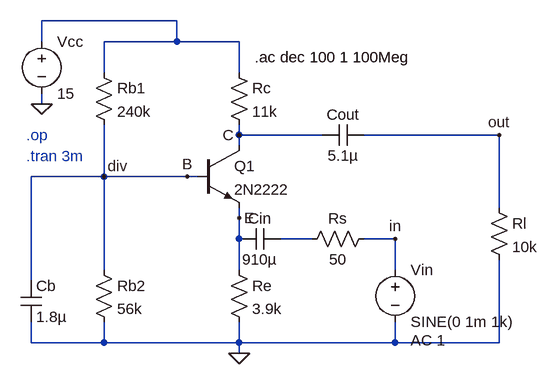
[diagram p0: schematic common_base_amplifier.asc]
common_base_amplifier.asc, the LTspice schematic file:
Version 4.1
SHEET 1 880 680
WIRE 128 -48 -80 -48
WIRE -80 -16 -80 -48
WIRE 128 -16 128 -48
WIRE 128 -16 16 -16
WIRE 224 -16 128 -16
WIRE 16 32 16 -16
WIRE 224 32 224 -16
WIRE -80 80 -80 64
WIRE 224 128 224 112
WIRE 352 128 224 128
WIRE 624 128 416 128
WIRE 224 144 224 128
WIRE 16 192 16 112
WIRE 16 192 -96 192
WIRE 144 192 16 192
WIRE 160 192 144 192
WIRE 624 240 624 128
WIRE 224 256 224 240
WIRE 224 288 224 256
WIRE 336 288 288 288
WIRE 464 288 416 288
WIRE 16 336 16 192
WIRE 224 336 224 288
WIRE 464 336 464 288
WIRE -96 352 -96 192
WIRE -96 448 -96 416
WIRE 16 448 16 416
WIRE 16 448 -96 448
WIRE 224 448 224 416
WIRE 224 448 16 448
WIRE 464 448 464 416
WIRE 464 448 224 448
WIRE 624 448 624 320
WIRE 624 448 464 448
WIRE 224 464 224 448
FLAG 224 464 0
FLAG 16 192 div
FLAG 144 192 B
FLAG 224 128 C
FLAG 224 256 E
FLAG -80 80 0
FLAG 464 288 in
FLAG 624 128 out
SYMBOL npn 160 144 R0
SYMATTR InstName Q1
SYMATTR Value 2N2222
SYMBOL res 0 16 R0
SYMATTR InstName Rb1
SYMATTR Value 240k
SYMBOL res 0 320 R0
SYMATTR InstName Rb2
SYMATTR Value 56k
SYMBOL res 208 320 R0
SYMATTR InstName Re
SYMATTR Value 3.9k
SYMBOL res 208 16 R0
SYMATTR InstName Rc
SYMATTR Value 11k
SYMBOL voltage -80 -32 R0
WINDOW 123 0 0 Left 0
WINDOW 39 0 0 Left 0
SYMATTR InstName Vcc
SYMATTR Value 15
SYMBOL cap 416 112 R90
WINDOW 0 0 32 VBottom 2
WINDOW 3 32 32 VTop 2
SYMATTR InstName Cout
SYMATTR Value 5.1µ
SYMBOL cap 288 272 R90
WINDOW 0 0 32 VBottom 2
WINDOW 3 32 32 VTop 2
SYMATTR InstName Cin
SYMATTR Value 910µ
SYMBOL cap -112 352 R0
SYMATTR InstName Cb
SYMATTR Value 1.8µ
SYMBOL voltage 464 320 R0
WINDOW 123 24 124 Left 2
WINDOW 39 24 124 Left 2
SYMATTR InstName Vin
SYMATTR Value SINE(0 1m 1k)
SYMATTR Value2 AC 1
SYMBOL res 608 224 R0
SYMATTR InstName Rl
SYMATTR Value 10k
SYMBOL res 432 272 R90
WINDOW 0 0 56 VBottom 2
WINDOW 3 32 56 VTop 2
SYMATTR InstName Rs
SYMATTR Value 50
TEXT -104 128 Left 2 ;.op
TEXT -104 160 Left 2 ;.tran 3m
TEXT 248 8 Left 2 !.ac dec 100 1 100Meg

The netlist it stands for:
* common_base_amplifier.asc
Q1 C B E 0 2N2222
Rb1 N001 B 240k
Rb2 B 0 56k
Re E 0 3.9k
Rc N001 C 11k
Vcc N001 0 15
Cout out C 5.1µ
Cin N002 E 910µ
Cb B 0 1.8µ
Vin in 0 SINE(0 1m 1k) AC 1
Rl out 0 10k
Rs in N002 50
.model NPN NPN
.model PNP PNP
.lib standard.bjt
* .op
* .tran 3m
.ac dec 100 1 100Meg
.backanno
.end